# Altium schematic sheet led_pack32.SchDoc
size A4
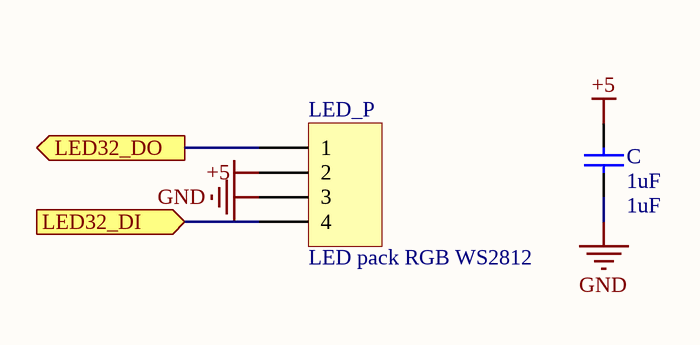
[diagram p0: led_pack32.SchDoc]

## Parts
C  1uF  [0603C]
LED_P  LED pack RGB WS2812  [PACK32-2121]  (no BOM)

## Ports
LED32_DI (in), LED32_DO (out)

## Nets
+5: C.2 LED_P.2
GND: C.1 LED_P.3
LED32_DI: LED_P.4 ; port LED32_DI
LED32_DO: LED_P.1 ; port LED32_DO

## Library data of the parts
C = Cap: CAP SMD 0603; Published: 8-Jun-2000; LatestRevisionDate: 17-Jul-2002; LatestRevisionNote: Re-released for DXP Platform.; PackageReference: RAD-0.3; Publisher: Altium Limited; PackageDescription: Radial Cap, Thru-Hole; 2 Leads; 0.3 in Pin Spacing; Value: 1uF
LED_P = Header 4: 8RGB LED pack; LatestRevisionDate: 17-Jul-2002; LatestRevisionNote: Re-released for DXP Platform.; Publisher: Altium Limited